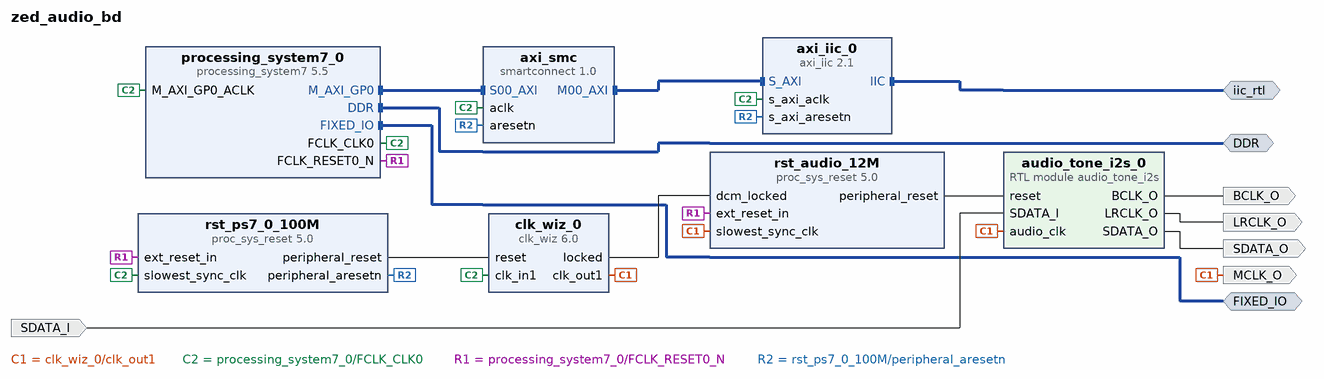
[diagram p0: block diagram of the top level]
# Vivado block design zed_audio_bd, xc7z020clg484-1, Vivado 2025.2
create_bd_design zed_audio_bd

create_bd_intf_port -mode Master -vlnv xilinx.com:interface:ddrx_rtl:1.0 DDR
create_bd_intf_port -mode Master -vlnv xilinx.com:display_processing_system7:fixedio_rtl:1.0 FIXED_IO
create_bd_intf_port -mode Master -vlnv xilinx.com:interface:iic_rtl:1.0 iic_rtl
create_bd_port -dir O -type clk MCLK_O
create_bd_port -dir O BCLK_O
create_bd_port -dir O LRCLK_O
create_bd_port -dir O SDATA_O
create_bd_port -dir I SDATA_I

create_bd_cell -type ip -vlnv xilinx.com:ip:processing_system7:5.5 processing_system7_0
set_property -dict [list \
  CONFIG.PCW_APU_PERIPHERAL_FREQMHZ 666.666667 \
  CONFIG.PCW_ENET0_ENET0_IO {MIO 16 .. 27} \
  CONFIG.PCW_ENET0_GRP_MDIO_ENABLE 1 \
  CONFIG.PCW_ENET0_GRP_MDIO_IO {MIO 52 .. 53} \
  CONFIG.PCW_ENET0_PERIPHERAL_ENABLE 1 \
  CONFIG.PCW_ENET0_RESET_ENABLE 0 \
  CONFIG.PCW_ENET_RESET_ENABLE 1 \
  CONFIG.PCW_ENET_RESET_SELECT {Share reset pin} \
  CONFIG.PCW_FPGA0_PERIPHERAL_FREQMHZ 100.000000 \
  CONFIG.PCW_FPGA1_PERIPHERAL_FREQMHZ 150.000000 \
  CONFIG.PCW_FPGA2_PERIPHERAL_FREQMHZ 50.000000 \
  CONFIG.PCW_GPIO_MIO_GPIO_ENABLE 1 \
  CONFIG.PCW_GPIO_MIO_GPIO_IO MIO \
  CONFIG.PCW_I2C_RESET_ENABLE 1 \
  CONFIG.PCW_PRESET_BANK1_VOLTAGE {LVCMOS 1.8V} \
  CONFIG.PCW_QSPI_GRP_SINGLE_SS_ENABLE 1 \
  CONFIG.PCW_QSPI_GRP_SINGLE_SS_IO {MIO 1 .. 6} \
  CONFIG.PCW_QSPI_PERIPHERAL_ENABLE 1 \
  CONFIG.PCW_QSPI_PERIPHERAL_FREQMHZ 200.000000 \
  CONFIG.PCW_QSPI_QSPI_IO {MIO 1 .. 6} \
  CONFIG.PCW_SD0_GRP_CD_ENABLE 1 \
  CONFIG.PCW_SD0_GRP_CD_IO {MIO 47} \
  CONFIG.PCW_SD0_GRP_WP_ENABLE 1 \
  CONFIG.PCW_SD0_GRP_WP_IO {MIO 46} \
  CONFIG.PCW_SD0_PERIPHERAL_ENABLE 1 \
  CONFIG.PCW_SD0_SD0_IO {MIO 40 .. 45} \
  CONFIG.PCW_SDIO_PERIPHERAL_FREQMHZ 50 \
  CONFIG.PCW_SINGLE_QSPI_DATA_MODE x4 \
  CONFIG.PCW_TTC0_PERIPHERAL_ENABLE 1 \
  CONFIG.PCW_TTC0_TTC0_IO EMIO \
  CONFIG.PCW_UART1_PERIPHERAL_ENABLE 1 \
  CONFIG.PCW_UART1_UART1_IO {MIO 48 .. 49} \
  CONFIG.PCW_UART_PERIPHERAL_FREQMHZ 50 \
  CONFIG.PCW_UIPARAM_DDR_FREQ_MHZ 533.333313 \
  CONFIG.PCW_UIPARAM_DDR_PARTNO {MT41J128M16 HA-15E} \
  CONFIG.PCW_USB0_PERIPHERAL_ENABLE 1 \
  CONFIG.PCW_USB0_RESET_ENABLE 0 \
  CONFIG.PCW_USB0_USB0_IO {MIO 28 .. 39} \
  CONFIG.PCW_USB_RESET_ENABLE 1 \
  CONFIG.PCW_USB_RESET_SELECT {Share reset pin} \
  CONFIG.preset ZedBoard \
] [get_bd_cells processing_system7_0]
# 221 more settings of processing_system7_0 are not shown: defaults, MIO pin electricals, DDR timing, and values the tool derives
create_bd_cell -type ip -vlnv xilinx.com:ip:axi_iic:2.1 axi_iic_0
create_bd_cell -type ip -vlnv xilinx.com:ip:smartconnect:1.0 axi_smc
set_property -dict {CONFIG.NUM_SI 1} [get_bd_cells axi_smc]
create_bd_cell -type ip -vlnv xilinx.com:ip:proc_sys_reset:5.0 rst_ps7_0_100M
create_bd_cell -type ip -vlnv xilinx.com:ip:clk_wiz:6.0 clk_wiz_0
set_property -dict [list \
  CONFIG.CLKOUT1_JITTER 360.948 \
  CONFIG.CLKOUT1_PHASE_ERROR 301.601 \
  CONFIG.CLKOUT1_REQUESTED_OUT_FREQ 12.288000 \
  CONFIG.CLKOUT2_JITTER 130.958 \
  CONFIG.CLKOUT2_PHASE_ERROR 98.575 \
  CONFIG.CLKOUT2_USED false \
  CONFIG.MMCM_CLKFBOUT_MULT_F 48.000 \
  CONFIG.MMCM_CLKOUT0_DIVIDE_F 78.125 \
  CONFIG.MMCM_CLKOUT1_DIVIDE 1 \
  CONFIG.MMCM_DIVCLK_DIVIDE 5 \
  CONFIG.NUM_OUT_CLKS 1 \
  CONFIG.PRIM_SOURCE No_buffer \
] [get_bd_cells clk_wiz_0]
create_bd_cell -type module -reference audio_tone_i2s audio_tone_i2s_0
create_bd_cell -type ip -vlnv xilinx.com:ip:proc_sys_reset:5.0 rst_audio_12M

# ---- connections ----

connect_bd_intf_net [get_bd_intf_ports iic_rtl] [get_bd_intf_pins axi_iic_0/IIC]
connect_bd_intf_net [get_bd_intf_pins axi_smc/M00_AXI] [get_bd_intf_pins axi_iic_0/S_AXI]
connect_bd_intf_net [get_bd_intf_ports DDR] [get_bd_intf_pins processing_system7_0/DDR]
connect_bd_intf_net [get_bd_intf_ports FIXED_IO] [get_bd_intf_pins processing_system7_0/FIXED_IO]
connect_bd_intf_net [get_bd_intf_pins processing_system7_0/M_AXI_GP0] [get_bd_intf_pins axi_smc/S00_AXI]
connect_bd_net [get_bd_ports SDATA_I] [get_bd_pins audio_tone_i2s_0/SDATA_I]
connect_bd_net [get_bd_pins audio_tone_i2s_0/BCLK_O] [get_bd_ports BCLK_O]
connect_bd_net [get_bd_pins audio_tone_i2s_0/LRCLK_O] [get_bd_ports LRCLK_O]
connect_bd_net [get_bd_pins audio_tone_i2s_0/SDATA_O] [get_bd_ports SDATA_O]
connect_bd_net [get_bd_pins clk_wiz_0/clk_out1] \
  [get_bd_ports MCLK_O] [get_bd_pins audio_tone_i2s_0/audio_clk] [get_bd_pins rst_audio_12M/slowest_sync_clk]
connect_bd_net [get_bd_pins clk_wiz_0/locked] [get_bd_pins rst_audio_12M/dcm_locked]
connect_bd_net [get_bd_pins processing_system7_0/FCLK_CLK0] \
  [get_bd_pins processing_system7_0/M_AXI_GP0_ACLK] [get_bd_pins axi_smc/aclk] [get_bd_pins axi_iic_0/s_axi_aclk] \
  [get_bd_pins rst_ps7_0_100M/slowest_sync_clk] [get_bd_pins clk_wiz_0/clk_in1]
connect_bd_net [get_bd_pins processing_system7_0/FCLK_RESET0_N] [get_bd_pins rst_ps7_0_100M/ext_reset_in] [get_bd_pins rst_audio_12M/ext_reset_in]
connect_bd_net [get_bd_pins rst_audio_12M/peripheral_reset] [get_bd_pins audio_tone_i2s_0/reset]
connect_bd_net [get_bd_pins rst_ps7_0_100M/peripheral_aresetn] [get_bd_pins axi_iic_0/s_axi_aresetn] [get_bd_pins axi_smc/aresetn]
connect_bd_net [get_bd_pins rst_ps7_0_100M/peripheral_reset] [get_bd_pins clk_wiz_0/reset]

# ---- address map ----
assign_bd_address -offset 0x41600000 -range 64K -target_address_space [get_bd_addr_spaces processing_system7_0/Data] [get_bd_addr_segs axi_iic_0/S_AXI/Reg]

validate_bd_design
save_bd_design
